# EAGLE schematic liang_shi_shui_fen (EAGLE 9.4.1)
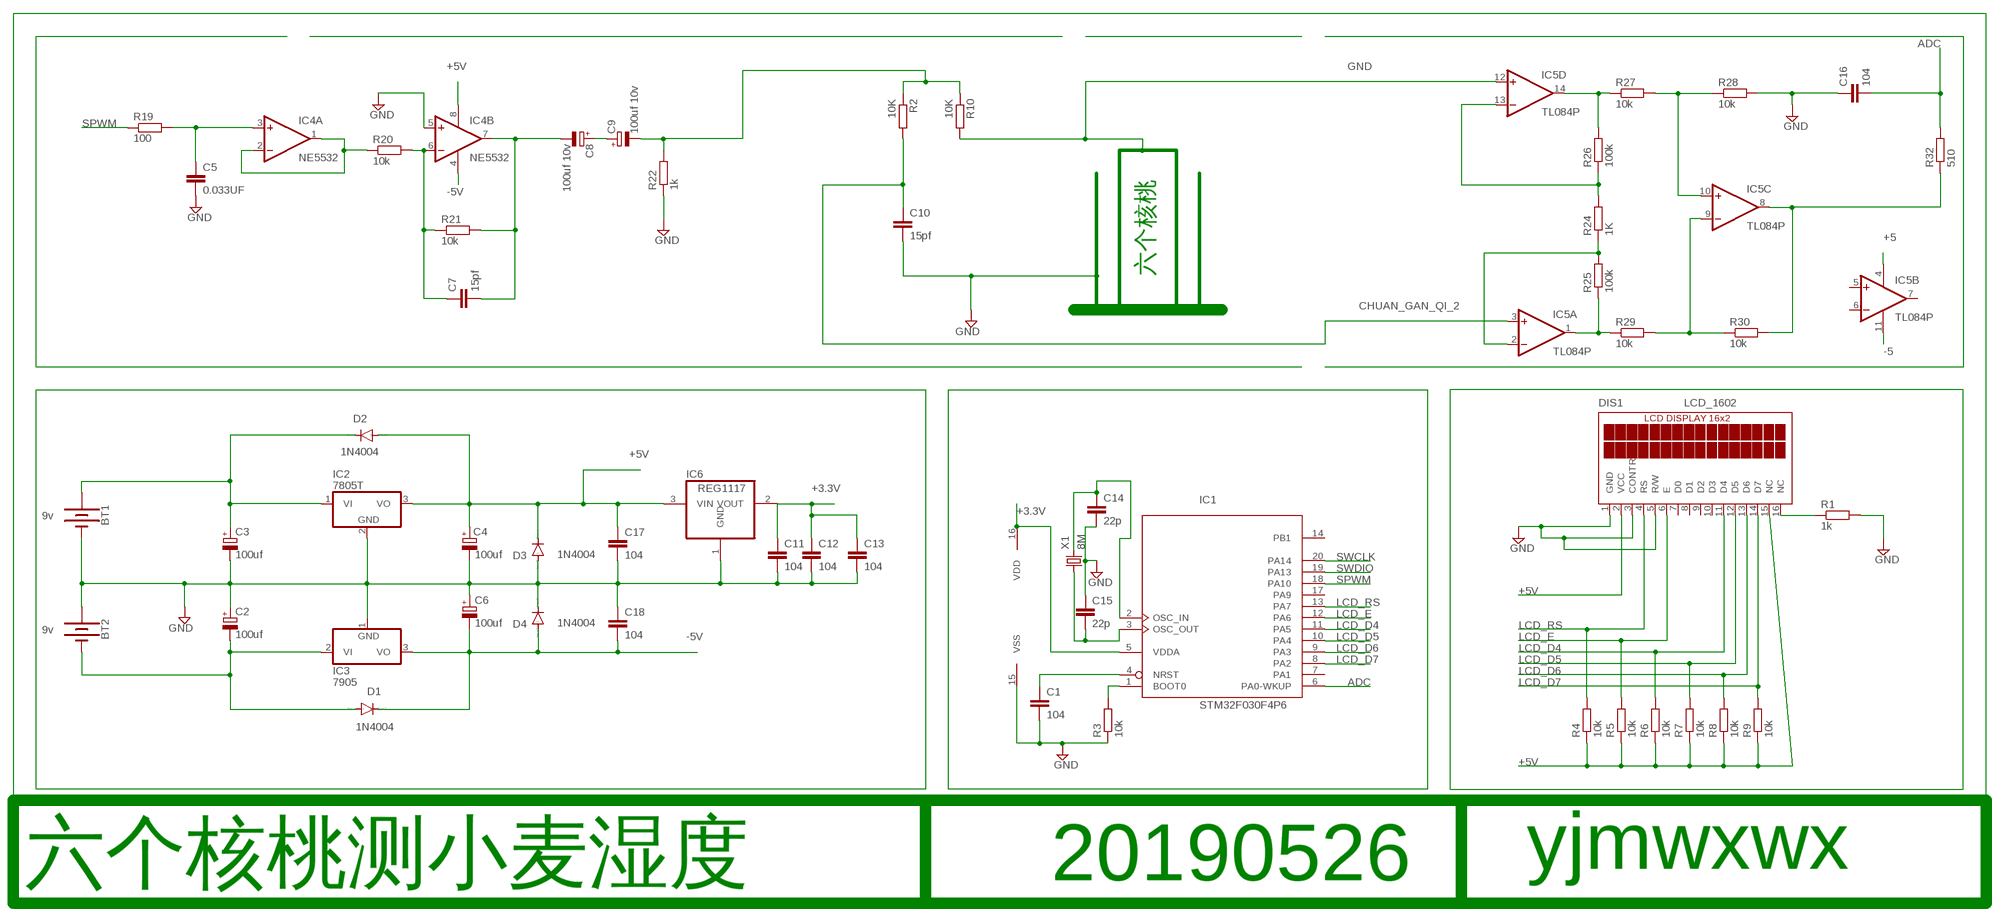
[diagram p0: schematic, sheet 1]

## Parts
BT1  9v  BATTERY-9V  [BATTCON_9V]
BT2  9v  BATTERY-9V  [BATTCON_9V]
C1  104  C2,5-3  [C2.5-3]
C2  100uf  CPOL-EUE2-5  [E2-5]
C3  100uf  CPOL-EUE2-5  [E2-5]
C4  100uf  CPOL-EUE2-5  [E2-5]
C5  0.033UF  C2,5-3  [C2.5-3]
C6  100uf  CPOL-EUE2-5  [E2-5]
C7  15pf  C2,5-3  [C2.5-3]
C8  100uf 10v  CPOL-EUE1.8-4  [E1,8-4]
C9  100uf 10v  CPOL-EUE1.8-4  [E1,8-4]
C10  15pf  C2,5-3  [C2.5-3]
C11  104  C2,5-3  [C2.5-3]
C12  104  C2,5-3  [C2.5-3]
C13  104  C2,5-3  [C2.5-3]
C14  22p  C2,5-3  [C2.5-3]
C15  22p  C2,5-3  [C2.5-3]
C16  104  C2,5-3  [C2.5-3]
C17  104  C2,5-3  [C2.5-3]
C18  104  C2,5-3  [C2.5-3]
D1  1N4004  [DO41-10]
D2  1N4004  [DO41-10]
D3  1N4004  [DO41-10]
D4  1N4004  [DO41-10]
DIS1  LCD_1602  TUXGR_16X2_R2  [TUXGR_16X2_R2]
IC1  STM32F030F4P6  STM32F030F4P  [TSSOP20-I]
IC2  7805T  [TO220H]
IC3  7905  7905T  [TO220H]
IC4  NE5532  TL082P  [DIL08]
IC5  TL084P  [DIL14]
IC6  REG1117  [SOT223]
R1  1k  R-EU_0204/5  [0204/5]
R2  10K  R-EU_0204/5  [0204/5]
R3  10k  R-EU_0204/5  [0204/5]
R4  10k  R-EU_0204/5  [0204/5]
R5  10k  R-EU_0204/5  [0204/5]
R6  10k  R-EU_0204/5  [0204/5]
R7  10k  R-EU_0204/5  [0204/5]
R8  10k  R-EU_0204/5  [0204/5]
R9  10k  R-EU_0204/5  [0204/5]
R10  10K  R-EU_0204/5  [0204/5]
R19  100  R-EU_0204/5  [0204/5]
R20  10k  R-EU_0204/5  [0204/5]
R21  10k  R-EU_0204/5  [0204/5]
R22  1k  R-EU_0204/5  [0204/5]
R24  1K  R-EU_0204/5  [0204/5]
R25  100k  R-EU_0204/5  [0204/5]
R26  100k  R-EU_0204/5  [0204/5]
R27  10k  R-EU_0204/5  [0204/5]
R28  10k  R-EU_0204/5  [0204/5]
R29  10k  R-EU_0204/5  [0204/5]
R30  10k  R-EU_0204/5  [0204/5]
R32  510  R-EU_0204/5  [0204/5]
X1  8M  CRYSTALS-NOGND-HC49/4H  [HC49]

## Nets
+3.3V: C11.1 C12.1 C13.1 IC1.5(VDDA) IC1.16(VDD) IC6.2(VOUT)
+5: IC5.4(P:V+)
+5V: C4.+ C17.1 D2.A D3.C DIS1.2(VCC) DIS1.15(NC) IC2.3(VO) IC4.8(P:V+) IC6.3(VIN) R4.1 R5.1 R6.1 R7.1 R8.1 R9.1
-5: IC5.11(P:V-)
-5V: C6.- C18.2 D1.C D4.A IC3.3(VO) IC4.4(P:V-)
ADC: C16.2 IC1.6(PA0-WKUP) R32.2
CHUAN_GAN_QI_2: C10.1 IC5.3(A:+IN) R2.2
GND: BT1.- BT2.+ C1.2 C2.+ C3.- C4.- C5.2 C6.+ C10.2 C11.2 C12.2 C13.2 C14.2 C15.1 C16.1 C17.2 C18.1 D3.A D4.C DIS1.1(GND) DIS1.3(CONTR) DIS1.5(R/W) IC1.15(VSS) IC2.2(GND) IC3.1(GND) IC4.5(B:+IN) IC5.12(D:+IN) IC6.1(GND) R1.2 R3.1 R10.2 R22.1 R28.2
LCD_D4: DIS1.11(D4) IC1.11(PA5) R6.2
LCD_D5: DIS1.12(D5) IC1.10(PA4) R7.2
LCD_D6: DIS1.13(D6) IC1.9(PA3) R8.2
LCD_D7: DIS1.14(D7) IC1.8(PA2) R9.2
LCD_E: DIS1.6(E) IC1.12(PA6) R5.2
LCD_RS: DIS1.4(RS) IC1.13(PA7) R4.2
N$4: IC1.1(BOOT0) R3.2
N$6: C1.1 IC1.4(NRST)
N$7: DIS1.16(NC) R1.1
N$8: IC4.1(A:OUT) IC4.2(A:-IN) R20.1
N$9: BT1.+ C3.+ D2.C IC2.1(VI)
N$11: C5.1 IC4.3(A:+IN) R19.2
N$13: IC5.2(A:-IN) R24.1 R25.2
N$14: BT2.- C2.- D1.A IC3.2(VI)
N$15: C7.1 IC4.6(B:-IN) R20.2 R21.1
N$18: C7.2 C8.- IC4.7(B:OUT) R21.2
N$20: C8.+ C9.+
N$22: IC5.14(D:OUT) R26.2 R27.1
N$23: IC5.1(A:OUT) R25.1 R29.1
N$25: IC5.13(D:-IN) R24.2 R26.1
N$26: IC5.10(C:+IN) R27.2 R28.1
N$27: IC5.9(C:-IN) R29.2 R30.1
N$34: C15.2 IC1.3(OSC_OUT) X1.1
N$35: C14.1 IC1.2(OSC_IN) X1.2
N$43: IC5.8(C:OUT) R30.2 R32.1
SPWM: IC1.18(PA10) R19.1
SWCLK: IC1.20(PA14)
SWDIO: IC1.19(PA13)
ZHENG_XIAN_BO: C9.- R2.1 R10.1 R22.2
Unconnected: DIS1.7(D0) DIS1.8(D1) DIS1.9(D2) DIS1.10(D3) IC1.7(PA1) IC1.14(PB1) IC1.17(PA9) IC5.5(B:+IN) IC5.6(B:-IN) IC5.7(B:OUT)

## Notes on the sheet
- 六个核桃
- 六个核桃测小麦湿度 | 20190526 | yjmwxwx

## Library data of the parts
BT1 BT2 = SparkFun-Batteries:BATTERY: Battery - Single Cell A variety of battery chemistries, sizes, and footprints. Device List: 20MM_PTH - Coin Cell Battery Holder - 20mm (PTH) <https://www.sparkfun.com/products/783> 6.8MM_PTH - Coin Cell Battery Holder - 6.8MM(SMD) <https://www.digikey.com/product-detail/en/seiko-instruments/MS621FE-FL11E/728-1057-ND/1889208?WT.srch=1&gclid=CNOQ5a6LzdQCFZS2wAodXCkE0g> 12MM_SMD - Coin Cell Battery Holder - 12mm (SMD) <https://www.sparkfun.com/products/10592> 12MM_PTH - Coin Cell Battery Holder - 12mm (PTH) <https://www.sparkfun.com/products/7948> 20MM_SMD - 20mm Coin Cell Battery Holder (SMD) (2 legs) Used on the Big Time Watch Kit <https://www.sparkfun.com/products/11734> 20MM_SMD_4LEGS - Coin Cell Battery Holder - 20mm (SMD) <https://www.sparkfun.com/products/11892> 20MM_SMD_4LEGS_OVERPASTE - Coin Cell Battery Holder - 20mm (SMD) <https://www.sparkfun.com/products/11892> (Over-paste on the legs) 24.5MM_PTH - Coin Cell Battery Holder - 24.5mm (PTH) <https://www.sparkfun.com/products/8863> 9V - 9V Battery Holder - PC Mount Used on the SparkFun SparkPunk Sound Kit <https://www.sparkfun.com/products/11177> and SparkFun SparkPunk Sequencer Kit <https://www.sparkfun.com/products/12707> 18650 - Battery Holder - 18650 (PTH) <https://www.sparkfun.com/products/13113> AA - Battery Holder - 1xAA (PTH) <https://www.sparkfun.com/products/7949> AAA - Battery Holder - 1xAAA (PTH) <https://www.sparkfun.com/products/12718> AA_KIT - Battery Holder - 1xAA (PTH) <https://www.sparkfun.com/products/7949> Special kit package - pads only have exposed copper on one side of the board. AAA_KIT - Battery Holder - 1xAAA (PTH) <https://www.sparkfun.com/products/12718> Special kit package - pads only have exposed copper on one side of the board.; PROD_ID: BATT-10855
C1 C5 C7 C10-C18 = capacitor-wima:C: CAPACITOR naming: grid - package width
C2-C4 C6 C8 C9 = rcl:CPOL-EU: POLARIZED CAPACITOR, European symbol; SPICEPREFIX: C
D1-D4 = diode:1N4004: DIODE general purpose rectifier, 1 A
DIS1 = display-lcd:TUXGR_16X2_R2: Tuxgraphics LCD display 16x2 characters reflective, without background light Source: tuxgr_12x2_r2.pdf; OC_FARNELL: unknown; OC_NEWARK: unknown
IC1 = micro-stm_v3:STM32F030F*P: ARM 32-bit Cortex™-M0 CPU 48 MHz maximum frequency 16 Kbytes of Flash memory 4 kbytes of SRAM 15 GPIOs 2.4 to 3.6 V application supply
IC2 = adafruit:78*: Positive VOLTAGE REGULATOR Added bigger pads to the TO-92 package
IC3 = linear:79*: Negative VOLTAGE REGULATOR
IC4 = linear:TL082: OP AMP Data sheet <http://www.ti.com/lit/ds/symlink/tl084a . pdf>; DATA_SHEET: <a href="http://www.ti.com/lit/ds/symlink/tl084a.pdf"> Data sheet </a>
IC5 = linear:TL084: OP AMP
IC6 = burr-brown:REG1117: 800mA and 1A Low Dropout (LDO) Positive Regulator 1.8V, 2.5V, 2.85V, 3.3V, 5V, and Adj; MPN: REG1117; OC_FARNELL: 1097566; OC_NEWARK: 14P6981
R1-R10 R19-R22 R24-R30 R32 = rcl:R-EU_: RESISTOR, European symbol; SPICEPREFIX: R
X1 = IQD-Frequency-Products:CRYSTALS-NOGND: CRYSTALS CAN NOT GROUNDED